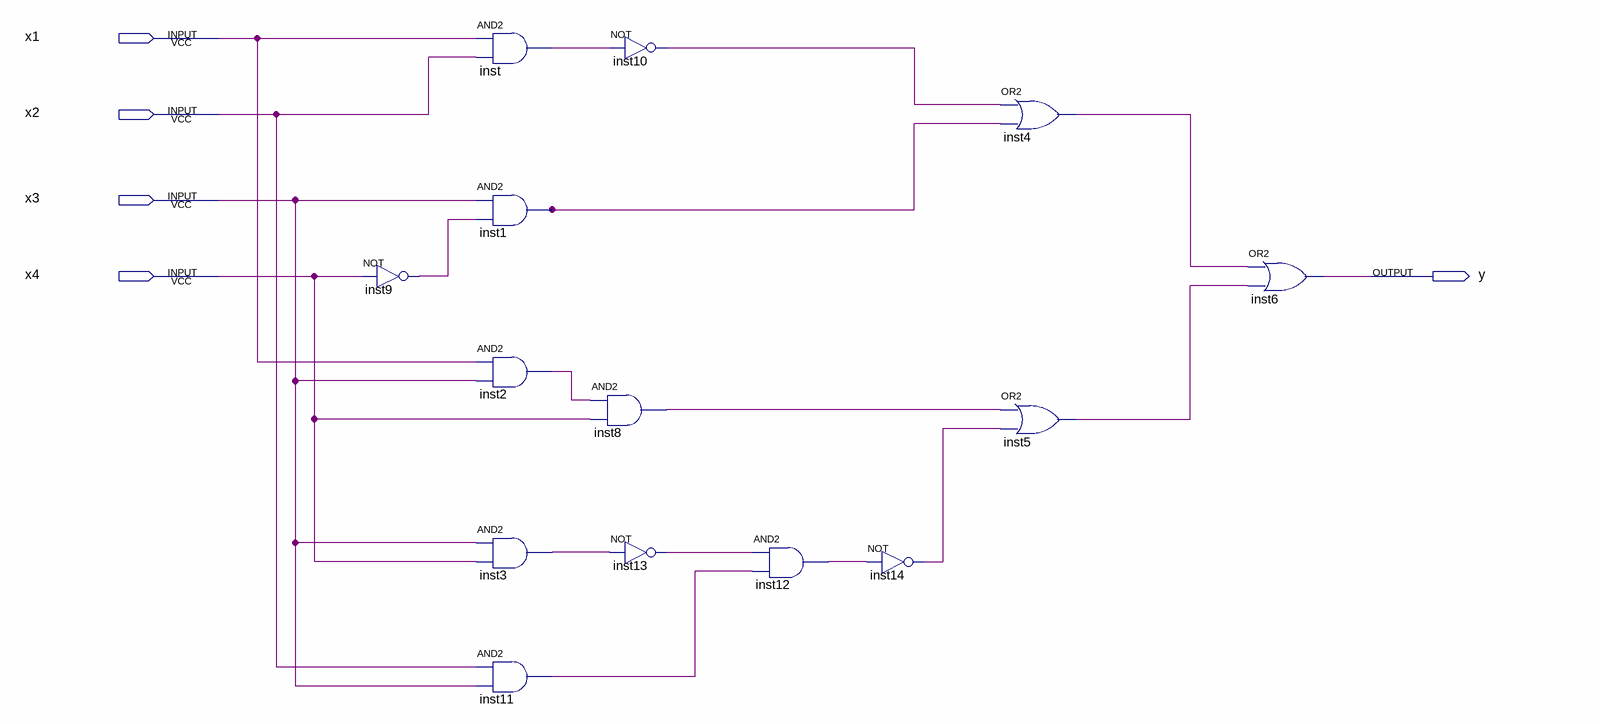
[diagram p0: schematic sheet]
// Quartus schematic FPGA_Lab1.bdf as structural Verilog: 14 symbols, 5 pins
module FPGA_Lab1 (
  input  x1,
  input  x2,
  input  x3,
  input  x4,
  output y
);

  wire inst1_out, inst2_out, inst3_out, inst4_out, inst5_out, inst8_out, inst9_out, inst10_out, inst11_out,
       inst12_out, inst13_out, inst14_out, inst_out;

  not inst9 (inst9_out, x4);
  and inst (inst_out, x1, x2);
  and inst1 (inst1_out, x3, inst9_out);
  and inst2 (inst2_out, x1, x3);
  and inst3 (inst3_out, x3, x4);
  and inst11 (inst11_out, x2, x3);
  and inst8 (inst8_out, inst2_out, x4);
  not inst10 (inst10_out, inst_out);
  not inst13 (inst13_out, inst3_out);
  and inst12 (inst12_out, inst13_out, inst11_out);
  not inst14 (inst14_out, inst12_out);
  or inst4 (inst4_out, inst10_out, inst1_out);
  or inst5 (inst5_out, inst8_out, inst14_out);
  or inst6 (y, inst4_out, inst5_out);
endmodule
